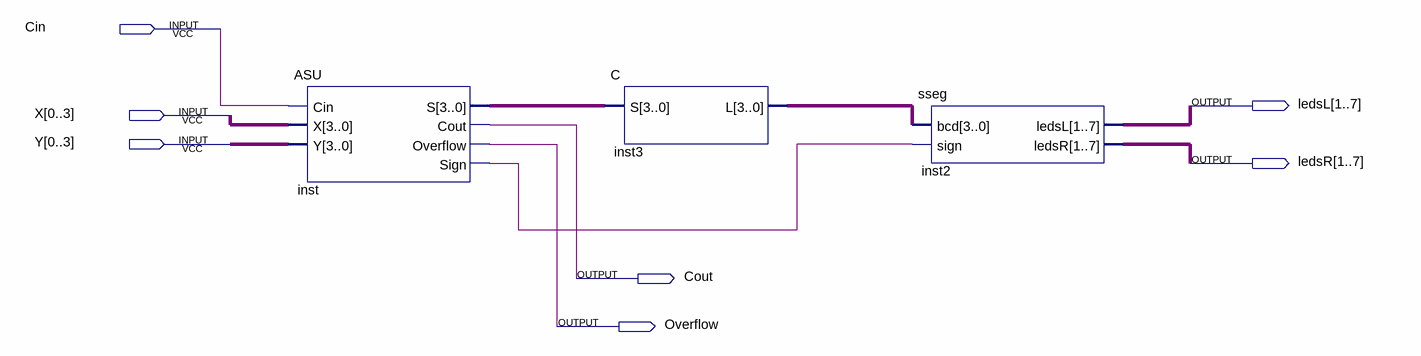
[diagram p0: schematic sheet]
// Quartus schematic CombinedASU2.bdf as structural Verilog: 3 symbols, 7 pins
module CombinedASU2 (
  input  Cin,
  input  [0:3] X,
  input  [0:3] Y,
  output [1:7] ledsL,
  output [1:7] ledsR,
  output Cout,
  output Overflow
);

  wire inst_sign;
  wire [3:0] inst3_l, inst_s;

  ASU inst (.Cin(Cin), .X(X), .Y(Y), .S(inst_s), .Cout(Cout), .Overflow(Overflow), .Sign(inst_sign));
  C inst3 (.S(inst_s), .L(inst3_l));
  sseg inst2 (.bcd(inst3_l), .sign(inst_sign), .ledsL(ledsL), .ledsR(ledsR));
endmodule
